# Altium schematic sheet DAP_C8T6.SchDoc
size 292 x 193 mm; Author: Power Lin; DocumentNumber: 2; SheetNumber: 2; SheetTotal: 3; Website: wiki-power.com
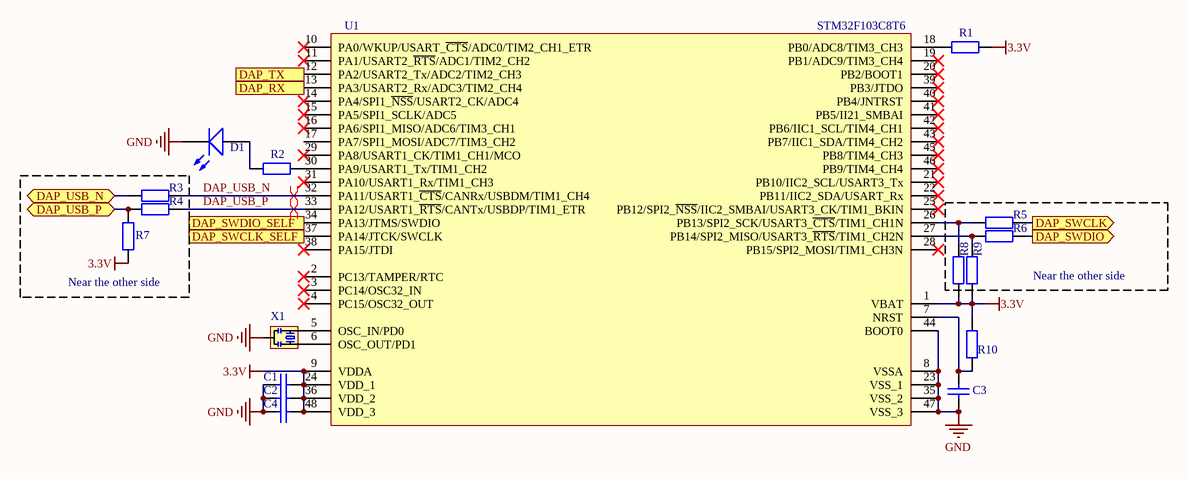
[diagram p0: DAP_C8T6.SchDoc]

## Parts
C1  100nF  [CAP-0603]  (value not drawn)
C2  100nF  [CAP-0603]  (value not drawn)
C3  100nF  [CAP-0603]  (value not drawn)
C4  100nF  [CAP-0603]  (value not drawn)
D1  RED  [LED_0603]  (value not drawn)
R1  10K  [R-0603]  (value not drawn)
R2  1K  [R-0603]  (value not drawn)
R3  39R  [R-0603]  (value not drawn)
R4  39R  [R-0603]  (value not drawn)
R5  39R  [R-0603]  (value not drawn)
R6  39R  [R-0603]  (value not drawn)
R7  1K  [R-0603]  (value not drawn)
R8  500R  [R-0603]  (value not drawn)
R9  500R  [R-0603]  (value not drawn)
R10  10K  [R-0603]  (value not drawn)
U1  STM32F103C8T6  [LQFP_48]
X1  8MHz  [CSTCE_G(A)村田晶振]  (value not drawn)

## Blocks framed on the sheet
Near the other side: R3 R4 R7
Near the other side: R5 R6 R8 R9

## Ports
DAP_RX (in), DAP_SWCLK (out), DAP_SWCLK_SELF (in), DAP_SWDIO (out), DAP_SWDIO_SELF (in), DAP_TX (out), DAP_USB_N (bidir), DAP_USB_P (bidir)

## Nets
3.3V: C1.1 C2.1 C4.1 R1.2 R7.1 R8.1 R9.1 R10.2 U1.1(VBAT) U1.9(VDDA) U1.24(VDD_1) U1.36(VDD_2) U1.48(VDD_3)
GND: C1.2 C2.2 C3.1 C4.2 D1.K U1.8(VSSA) U1.23(VSS_1) U1.35(VSS_2) U1.44(BOOT0) U1.47(VSS_3) X1.2(GND)
DAP_RX: U1.13(PA3/USART2_Rx/ADC3/TIM2_CH4) ; port DAP_RX
DAP_SWCLK: R5.2 ; port DAP_SWCLK
DAP_SWCLK_SELF: U1.37(PA14/JTCK/SWCLK) ; port DAP_SWCLK_SELF
DAP_SWDIO: R6.2 ; port DAP_SWDIO
DAP_SWDIO_SELF: U1.34(PA13/JTMS/SWDIO) ; port DAP_SWDIO_SELF
DAP_TX: U1.12(PA2/USART2_Tx/ADC2/TIM2_CH3) ; port DAP_TX
DAP_USB_N: R3.2 U1.32(PA11/USART1_~{CTS}/CANRx/USBDM/TIM1_CH4)
DAP_USB_N: R3.1 ; port DAP_USB_N  [a separate net that carries the same name]
DAP_USB_P: R4.2 U1.33(PA12/USART1_~{RTS}/CANTx/USBDP/TIM1_ETR)
DAP_USB_P: R4.1 R7.2 ; port DAP_USB_P  [a separate net that carries the same name]
NetC3_2: C3.2 R10.1 U1.7(NRST)
NetD1_A: D1.A R2.1
NetR1_1: R1.1 U1.18(PB0/ADC8/TIM3_CH3)
NetR2_2: R2.2 U1.30(PA9/USART1_Tx/TIM1_CH2)
NetR5_1: R5.1 R8.2 U1.26(PB13/SPI2_SCK/USART3_~{CTS}/TIM1_CH1N)
NetR6_1: R6.1 R9.2 U1.27(PB14/SPI2_MISO/USART3_~{RTS}/TIM1_CH2N)
NetU1_5: U1.5(OSC_IN/PD0) X1.1(OSC1)
NetU1_6: U1.6(OSC_OUT/PD1) X1.3(OSC2)

Not connected (* = marked no-connect by the designer): U1 2(PC13/TAMPER/RTC)* 3(PC14/OSC32_IN)* 4(PC15/OSC32_OUT)* 10(PA0/WKUP/USART_~{CTS}/ADC0/TIM2_CH1_ETR)* 11(PA1/USART2_~{RTS}/ADC1/TIM2_CH2)* 14(PA4/SPI1_~{NSS}/USART2_CK/ADC4)* 15(PA5/SPI1_SCLK/ADC5)* 16(PA6/SPI1_MISO/ADC6/TIM3_CH1)* 17(PA7/SPI1_MOSI/ADC7/TIM3_CH2) 19(PB1/ADC9/TIM3_CH4)* 20(PB2/BOOT1)* 21(PB10/IIC2_SCL/USART3_Tx)* 22(PB11/IIC2_SDA/USART_Rx)* 25(PB12/SPI2_~{NSS}/IIC2_SMBAI/USART3_CK/TIM1_BKIN)* 28(PB15/SPI2_MOSI/TIM1_CH3N)* 29(PA8/USART1_CK/TIM1_CH1/MCO)* 31(PA10/USART1_Rx/TIM1_CH3)* 38(PA15/JTDI)* 39(PB3/JTDO)* 40(PB4/JNTRST)* 41(PB5/II21_SMBAI)* 42(PB6/IIC1_SCL/TIM4_CH1)* 43(PB7/IIC1_SDA/TIM4_CH2)* 45(PB8/TIM4_CH3)* 46(PB9/TIM4_CH4)*

## Layout directives
differential pair: DAP_USB_N, DAP_USB_P

## Notes on the sheet
- Author
- DocumentName
- ModifiedDate
- ProjectName
- SheetNumber
- SheetTotal
- Website
- Revision

## Library data of the parts
C1-C4 = CAP: 贴片电容; ComponentLink1Description: 供应商链接; ComponentLink1URL: http://www.szlcsc.com/product/details_53938.html; Package: 0402; Supplier: LC; SuppliersPartNumber: C52923
D1 = LED: 发光二极管; ComponentLink1Description: 供应商链接; ComponentLink1URL: http://www.szlcsc.com/product/details_2663.html; Package: 0603; Supplier: LC; SuppliersPartNumber: C2290
R1-R10 = RES: 贴片电阻; Package: 0805; Supplier: LC; SuppliersPartNumber: C17798
U1 = STM32F103Cx: 微控制器
X1 = XTAL: 有源晶振